# Altium schematic sheet Mixer.SchDoc: Multi-Channel Design
size 431 x 279 mm; Organization: Altium Limited; Address1: L3, 12a Rodborough Rd; Address2: Frenchs Forest; Address3: NSW; Address4: Australia 2086; DocumentNumber: 5; SheetNumber: 5; SheetTotal: 8
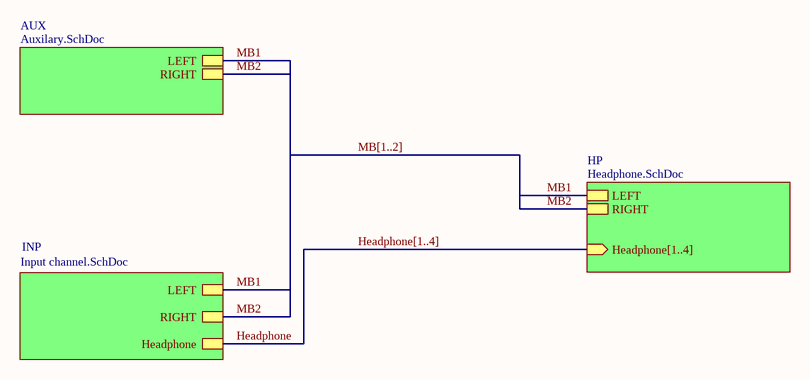
[diagram p0: Mixer.SchDoc]

## Sub-sheets
AUX = Auxilary.SchDoc: LEFT, RIGHT
HP = Headphone.SchDoc: Headphone[1..4] (in), LEFT, RIGHT
INP = Input channel.SchDoc: LEFT, RIGHT, Headphone

## Nets
Headphone: sheet INP/Headphone
MB1: sheet AUX/LEFT, sheet HP/LEFT, sheet INP/LEFT
MB2: sheet AUX/RIGHT, sheet HP/RIGHT, sheet INP/RIGHT

## Buses and harness runs
bus Headphone[1..4] = sheet HP/Headphone[1..4]
bus MB[1..2]

## Notes on the sheet
- 8
- 7
- 6
- 5
- 4
- 3
- DWG. NO.
- REV.
- SHT.
- 2
- 1
- THIS DOCUMENT AND THE DATA DISCLOSED HEREIN OR HEREWITH IS THE PROPERTY OF ALTIUM LIMITED AND MAY BE FREELY DISTRIBUTED IN WHOLE. NO RIGHTS ARE RESERVED OR EXPRESS OR IMPLIED WARANTEE GIVEN.
- REVISION
- DESCRIPTION
- DATE
- APPROVED
- F
- E
- D
- C
- B
- ENG:
- APPROVALS
- PROJECT
- A
- DSN:
- CHK:
- REFERENCE DOCUMENTS
- PROJECT REVISION:
- TITLE
- DOCUMENT REVISION:
- DESIGN ITEM:
- BOM:
- FAB DWG:
- PCB DWG:
- ASSY DWG:
- SCALE:
- SIZE
- CAGE CODE
- FILE NAME
- DWG NO.
- SHEET
- OF
- REV